# Altium schematic sheet Sheet7.SchDoc
size A4
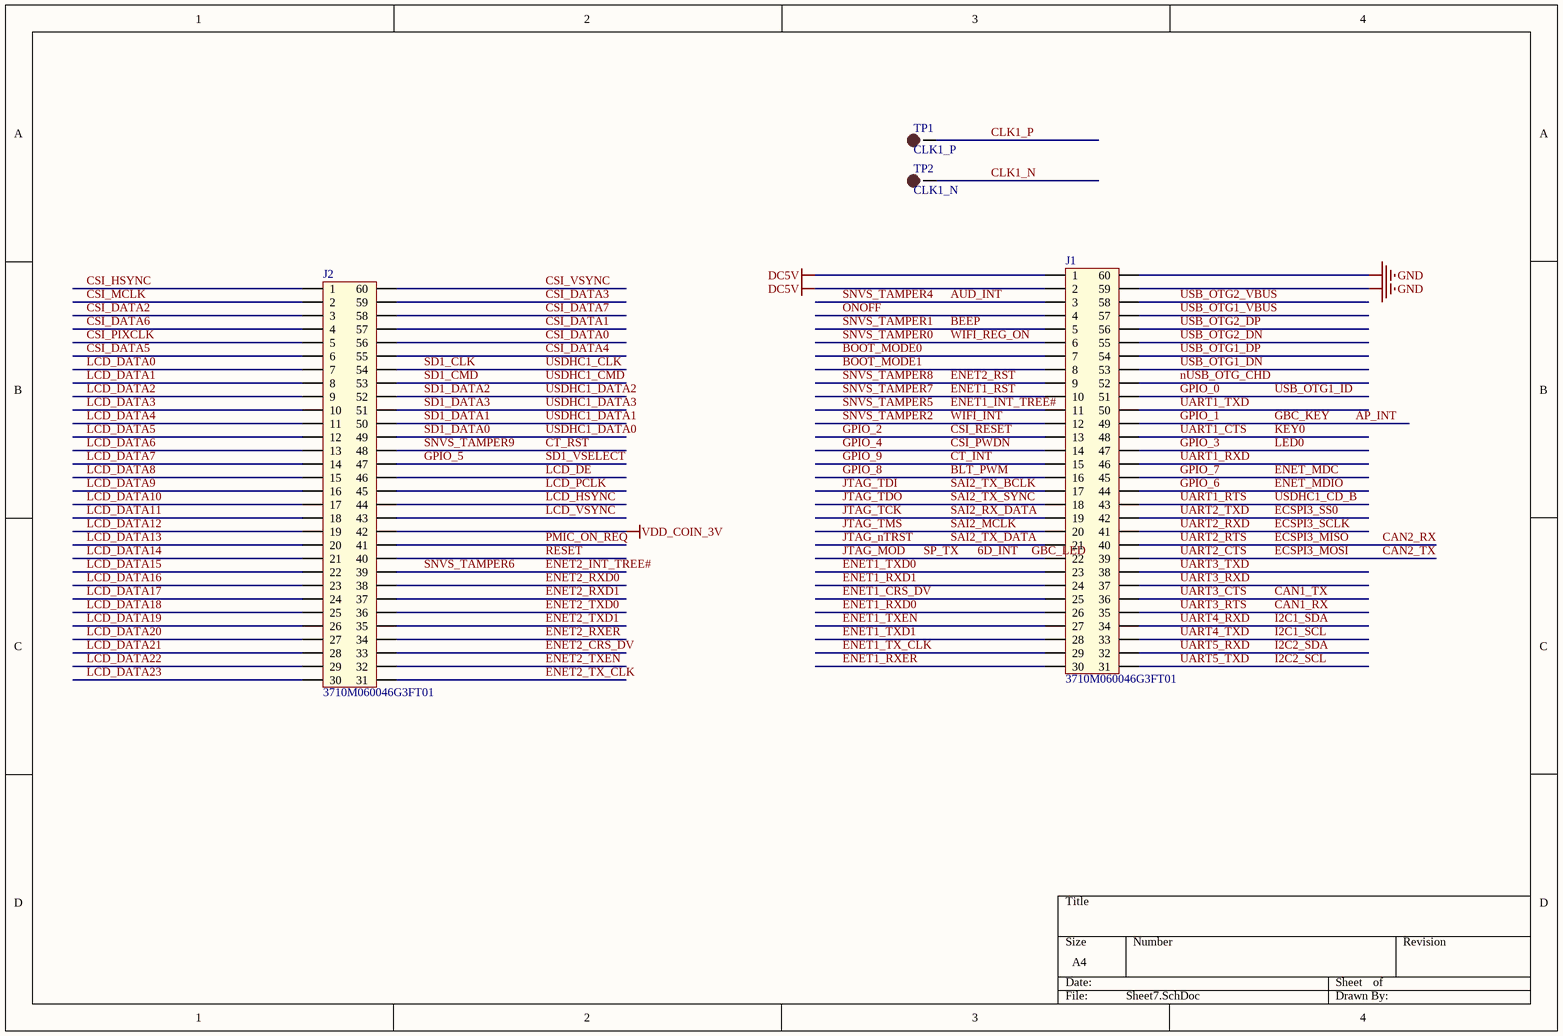
[diagram p0: Sheet7.SchDoc]

## Parts
J1  3710M060046G3FT01  [3710F060046G3FT01]
J2  3710M060046G3FT01  [3710F060046G3FT01]
TP1  CLK1_P  [TP-1.0]
TP2  CLK1_N  [TP-1.0]

## Nets
DC5V: J1.1 J1.2
GND: J1.59 J1.60
VDD_COIN_3V: J2.42
6D_INT: J1.22  [also labelled GBC_LED, JTAG_MOD, SP_TX]
AP_INT: J1.49  [also labelled GBC_KEY, GPIO_1]
AUD_INT: J1.3  [also labelled SNVS_TAMPER4]
BEEP: J1.5  [also labelled SNVS_TAMPER1]
BLT_PWM: J1.16  [also labelled GPIO_8]
BOOT_MODE0: J1.7
BOOT_MODE1: J1.8
CAN1_RX: J1.35  [also labelled UART3_RTS]
CAN1_TX: J1.36  [also labelled UART3_CTS]
CAN2_RX: J1.40  [also labelled ECSPI3_MISO, UART2_RTS]
CAN2_TX: J1.39  [also labelled ECSPI3_MOSI, UART2_CTS]
CLK1_N: TP2.1
CLK1_P: TP1.1
CSI_DATA0: J2.56
CSI_DATA1: J2.57
CSI_DATA2: J2.3
CSI_DATA3: J2.59
CSI_DATA4: J2.55
CSI_DATA5: J2.6
CSI_DATA6: J2.4
CSI_DATA7: J2.58
CSI_HSYNC: J2.1
CSI_MCLK: J2.2
CSI_PIXCLK: J2.5
CSI_PWDN: J1.14  [also labelled GPIO_4]
CSI_RESET: J1.13  [also labelled GPIO_2]
CSI_VSYNC: J2.60
CT_INT: J1.15  [also labelled GPIO_9]
CT_RST: J2.48  [also labelled SNVS_TAMPER9]
ECSPI3_SCLK: J1.41  [also labelled UART2_RXD]
ECSPI3_SS0: J1.42  [also labelled UART2_TXD]
ENET1_CRS_DV: J1.25
ENET1_INT_TREE#: J1.11  [also labelled SNVS_TAMPER5]
ENET1_RST: J1.10  [also labelled SNVS_TAMPER7]
ENET1_RXD0: J1.26
ENET1_RXD1: J1.24
ENET1_RXER: J1.30
ENET1_TX_CLK: J1.29
ENET1_TXD0: J1.23
ENET1_TXD1: J1.28
ENET1_TXEN: J1.27
ENET2_CRS_DV: J2.33
ENET2_INT_TREE#: J2.39  [also labelled SNVS_TAMPER6]
ENET2_RST: J1.9  [also labelled SNVS_TAMPER8]
ENET2_RXD0: J2.38
ENET2_RXD1: J2.37
ENET2_RXER: J2.34
ENET2_TX_CLK: J2.31
ENET2_TXD0: J2.36
ENET2_TXD1: J2.35
ENET2_TXEN: J2.32
ENET_MDC: J1.45  [also labelled GPIO_7]
ENET_MDIO: J1.44  [also labelled GPIO_6]
GPIO_0: J1.51  [also labelled USB_OTG1_ID]
GPIO_3: J1.47  [also labelled LED0]
GPIO_5: J2.47  [also labelled SD1_VSELECT]
I2C1_SCL: J1.33  [also labelled UART4_TXD]
I2C1_SDA: J1.34  [also labelled UART4_RXD]
I2C2_SCL: J1.31  [also labelled UART5_TXD]
I2C2_SDA: J1.32  [also labelled UART5_RXD]
JTAG_nTRST: J1.21  [also labelled SAI2_TX_DATA]
JTAG_TCK: J1.19  [also labelled SAI2_RX_DATA]
JTAG_TDI: J1.17  [also labelled SAI2_TX_BCLK]
JTAG_TDO: J1.18  [also labelled SAI2_TX_SYNC]
JTAG_TMS: J1.20  [also labelled SAI2_MCLK]
KEY0: J1.48  [also labelled UART1_CTS]
LCD_DATA0: J2.7
LCD_DATA1: J2.8
LCD_DATA2: J2.9
LCD_DATA3: J2.10
LCD_DATA4: J2.11
LCD_DATA5: J2.12
LCD_DATA6: J2.13
LCD_DATA7: J2.14
LCD_DATA8: J2.15
LCD_DATA9: J2.16
LCD_DATA10: J2.17
LCD_DATA11: J2.18
LCD_DATA12: J2.19
LCD_DATA13: J2.20
LCD_DATA14: J2.21
LCD_DATA15: J2.22
LCD_DATA16: J2.23
LCD_DATA17: J2.24
LCD_DATA18: J2.25
LCD_DATA19: J2.26
LCD_DATA20: J2.27
LCD_DATA21: J2.28
LCD_DATA22: J2.29
LCD_DATA23: J2.30
LCD_DE: J2.46
LCD_HSYNC: J2.44
LCD_PCLK: J2.45
LCD_VSYNC: J2.43
nUSB_OTG_CHD: J1.52
ONOFF: J1.4
PMIC_ON_REQ: J2.41
RESET: J2.40
SD1_CLK: J2.54  [also labelled USDHC1_CLK]
SD1_CMD: J2.53  [also labelled USDHC1_CMD]
SD1_DATA0: J2.49  [also labelled USDHC1_DATA0]
SD1_DATA1: J2.50  [also labelled USDHC1_DATA1]
SD1_DATA2: J2.52  [also labelled USDHC1_DATA2]
SD1_DATA3: J2.51  [also labelled USDHC1_DATA3]
SNVS_TAMPER0: J1.6  [also labelled WIFI_REG_ON]
SNVS_TAMPER2: J1.12  [also labelled WIFI_INT]
UART1_RTS: J1.43  [also labelled USDHC1_CD_B]
UART1_RXD: J1.46
UART1_TXD: J1.50
UART3_RXD: J1.37
UART3_TXD: J1.38
USB_OTG1_DN: J1.53
USB_OTG1_DP: J1.54
USB_OTG1_VBUS: J1.57
USB_OTG2_DN: J1.55
USB_OTG2_DP: J1.56
USB_OTG2_VBUS: J1.58

## Library data of the parts
J1 J2 = 3710F: 3710F060046G3FT01
TP1 TP2 = TEST-POINT: 测试点